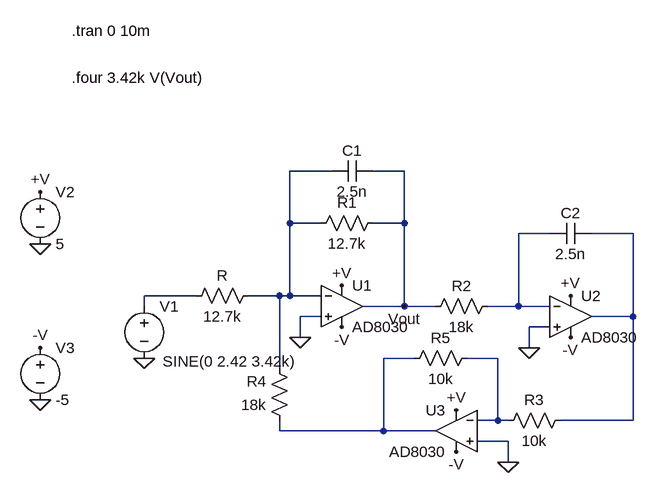
[diagram p0: schematic Stage2_Transient.asc]
Stage2_Transient.asc, the LTspice schematic file:
Version 4
SHEET 1 880 680
WIRE 304 -32 240 -32
WIRE 416 -32 368 -32
WIRE 240 48 240 -32
WIRE 288 48 240 48
WIRE 416 48 416 -32
WIRE 416 48 368 48
WIRE 640 64 592 64
WIRE 768 64 704 64
WIRE 96 160 16 160
WIRE 224 160 176 160
WIRE 240 160 240 48
WIRE 240 160 224 160
WIRE 288 160 240 160
WIRE 16 176 16 160
WIRE 416 176 416 48
WIRE 416 176 352 176
WIRE 464 176 416 176
WIRE 592 176 592 64
WIRE 592 176 544 176
WIRE 640 176 592 176
WIRE 288 192 256 192
WIRE 768 192 768 64
WIRE 768 192 704 192
WIRE 640 208 608 208
WIRE 256 224 256 192
WIRE 608 240 608 208
WIRE 432 256 384 256
WIRE 560 256 512 256
WIRE 224 272 224 160
WIRE 560 352 560 256
WIRE 560 352 528 352
WIRE 576 352 560 352
WIRE 768 352 768 192
WIRE 768 352 656 352
WIRE 224 368 224 352
WIRE 384 368 384 256
WIRE 384 368 224 368
WIRE 464 368 384 368
WIRE 576 384 528 384
WIRE 576 416 576 384
FLAG -144 80 0
FLAG -144 320 0
FLAG -144 0 +V
FLAG -144 240 -V
FLAG 16 256 0
FLAG 416 176 Vout
FLAG 256 224 0
FLAG 576 416 0
FLAG 608 240 0
FLAG 320 144 +V
FLAG 672 160 +V
FLAG 496 336 +V
FLAG 320 208 -V
FLAG 496 400 -V
FLAG 672 224 -V
SYMBOL voltage 16 160 R0
WINDOW 3 28 101 Left 2
WINDOW 123 24 124 Left 2
WINDOW 39 0 0 Left 0
SYMATTR Value SINE(0 2.42 3.42k)
SYMATTR InstName V1
SYMBOL voltage -144 -16 R0
SYMATTR InstName V2
SYMATTR Value 5
SYMBOL voltage -144 224 R0
SYMATTR InstName V3
SYMATTR Value -5
SYMBOL res 384 32 R90
WINDOW 0 0 56 VBottom 2
WINDOW 3 32 56 VTop 2
SYMATTR InstName R1
SYMATTR Value 12.7k
SYMBOL res 560 160 R90
WINDOW 0 0 56 VBottom 2
WINDOW 3 32 56 VTop 2
SYMATTR InstName R2
SYMATTR Value 18k
SYMBOL res 672 336 R90
WINDOW 0 0 56 VBottom 2
WINDOW 3 32 56 VTop 2
SYMATTR InstName R3
SYMATTR Value 10k
SYMBOL res 240 368 R180
WINDOW 0 36 76 Left 2
WINDOW 3 36 40 Left 2
SYMATTR InstName R4
SYMATTR Value 18k
SYMBOL cap 368 -48 R90
WINDOW 0 0 32 VBottom 2
WINDOW 3 32 32 VTop 2
SYMATTR InstName C1
SYMATTR Value 2.5n
SYMBOL cap 704 48 R90
WINDOW 0 0 32 VBottom 2
WINDOW 3 32 32 VTop 2
SYMATTR InstName C2
SYMATTR Value 2.5n
SYMBOL res 528 240 R90
WINDOW 0 0 56 VBottom 2
WINDOW 3 32 56 VTop 2
SYMATTR InstName R5
SYMATTR Value 10k
SYMBOL OpAmps\\AD8030 320 112 R0
SYMATTR InstName U1
SYMBOL OpAmps\\AD8030 672 128 R0
SYMATTR InstName U2
SYMBOL OpAmps\\AD8030 496 304 M0
SYMATTR InstName U3
SYMBOL res 192 144 R90
WINDOW 0 0 56 VBottom 2
WINDOW 3 32 56 VTop 2
SYMATTR InstName R
SYMATTR Value 12.7k
TEXT -96 -248 Left 2 !.tran 0 10m
TEXT -96 -176 Left 2 !.four 3.42k V(Vout)

The netlist it stands for:
* Stage2_Transient.asc
V1 N004 0 SINE(0 2.42 3.42k)
V2 +V 0 5
V3 -V 0 -5
R1 Vout N001 12.7k
R2 N002 Vout 18k
R3 N003 N006 10k
R4 N005 N001 18k
C1 Vout N001 2.5n
C2 N003 N002 2.5n
R5 N006 N005 10k
XU1 0 N001 +V -V Vout AD8040  ; AD8030, pins In+ In- V+ V- OUT
XU2 0 N002 +V -V N003 AD8040  ; AD8030, pins In+ In- V+ V- OUT
XU3 0 N006 +V -V N005 AD8040  ; AD8030, pins In+ In- V+ V- OUT
R N001 N004 12.7k
.tran 0 10m
.four 3.42k V(Vout)
.lib ADI.lib
.backanno
.end